# EAGLE design battery_board (EAGLE 6.6.0)
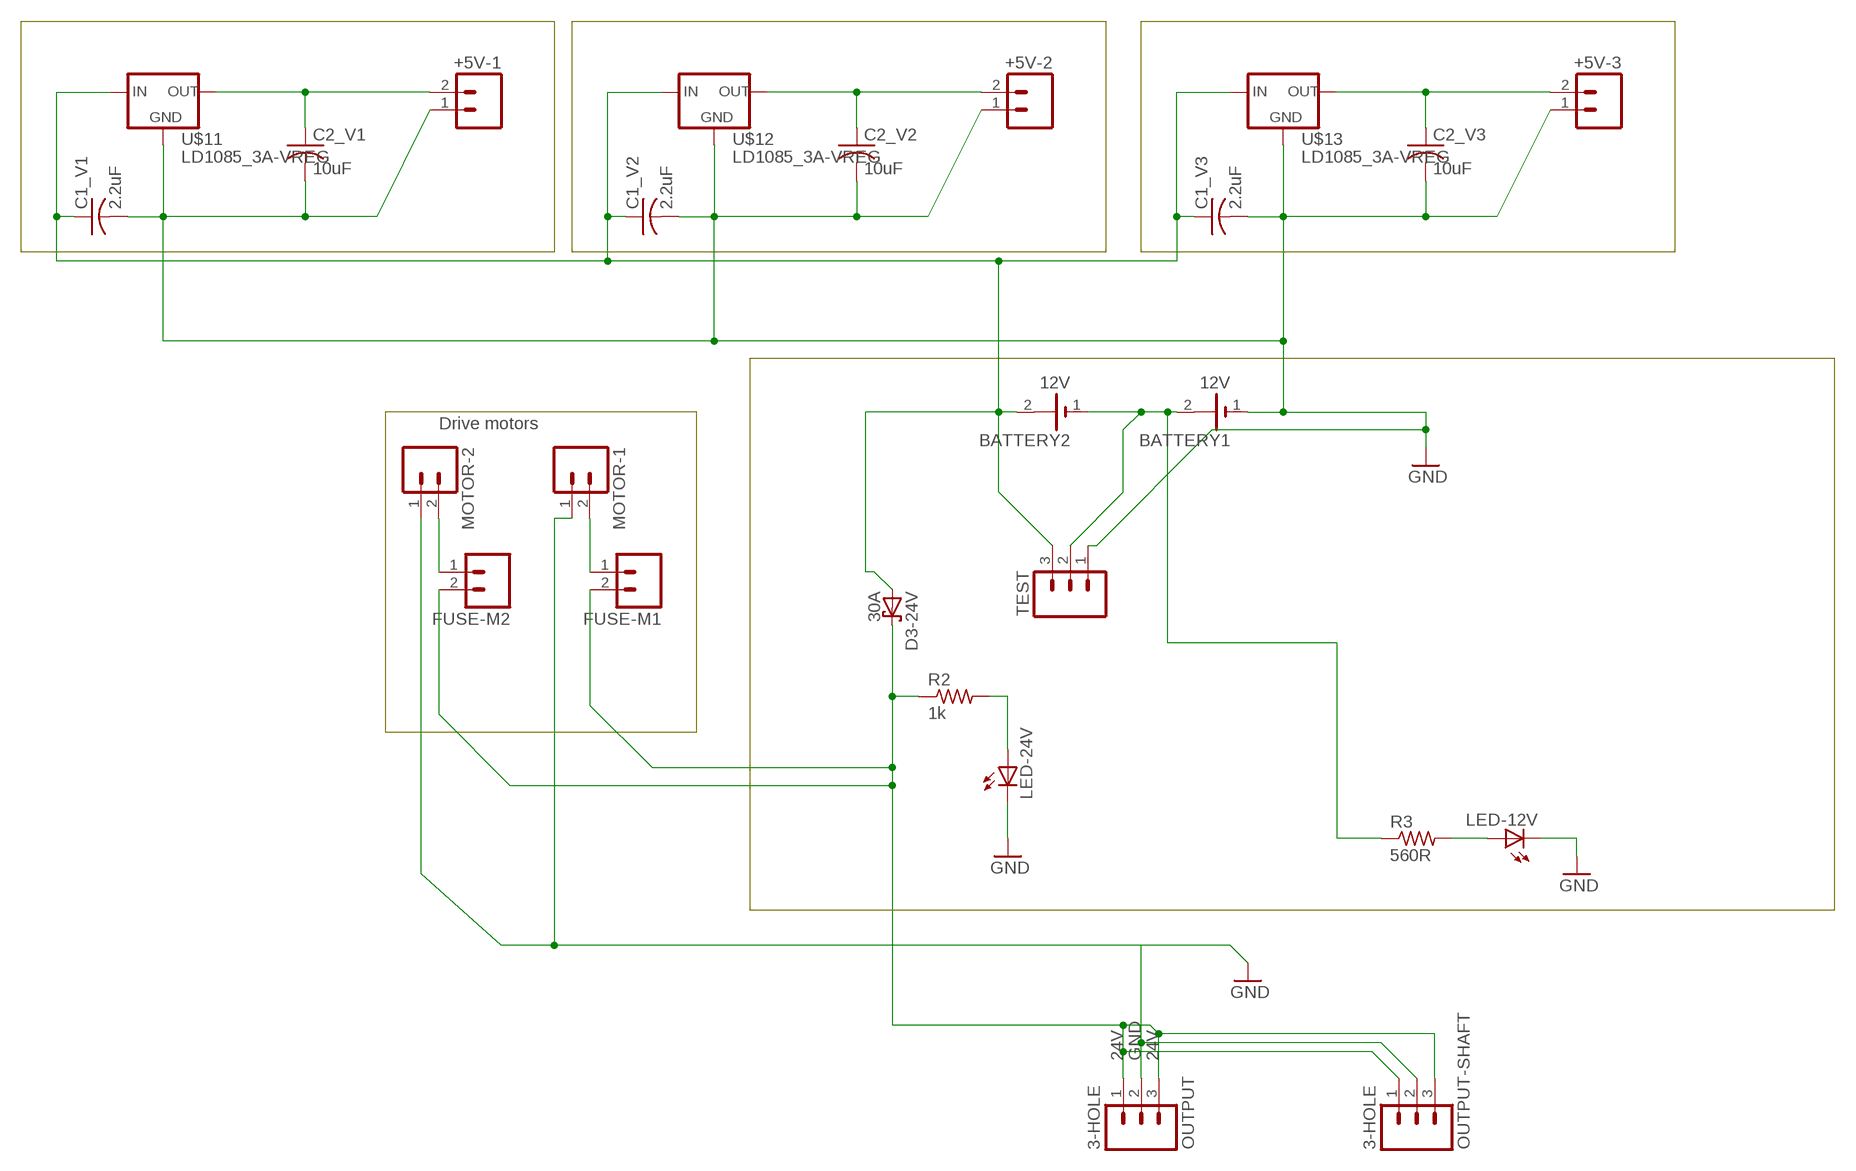
[diagram p0: schematic, sheet 1]

## Parts
+5V-1  2-HOLESSC3.81MM  [SCREWTERMINAL-3.81MM]
+5V-2  2-HOLESSC3.81MM  [SCREWTERMINAL-3.81MM]
+5V-3  2-HOLESSC3.81MM  [SCREWTERMINAL-3.81MM]
BATTERY1  12V  BATTERY-ST  [SCREWTERMINAL-5MM-2]
BATTERY2  12V  BATTERY-ST  [SCREWTERMINAL-5MM-2]
C1_V1  2.2uF  CAPACITOR  [C050-024X044]
C1_V2  2.2uF  CAPACITOR  [C050-024X044]
C1_V3  2.2uF  CAPACITOR  [C050-024X044]
C2_V1  10uF  CAPACITOR  [C050-024X044]
C2_V2  10uF  CAPACITOR  [C050-024X044]
C2_V3  10uF  CAPACITOR  [C050-024X044]
D3-24V  30A  POWER_RECTIFIER-H  [TO22-DIODE-H]
FUSE-M1  3A  2-HOLESSC5MM  [SCREWTERMINAL-5MM-2]
FUSE-M2  3A  2-HOLESSC5MM  [SCREWTERMINAL-5MM-2]
LED-12V  LED-5MM  [LED5MM]
LED-24V  LED-5MM  [LED5MM]
MOTOR-1  2-HOLESSC5MM  [SCREWTERMINAL-5MM-2]
MOTOR-2  2-HOLESSC5MM  [SCREWTERMINAL-5MM-2]
OUTPUT  3-HOLE  [SCREWTERMINAL-5MM-3@1]
OUTPUT-SHAFT  3-HOLE  [SCREWTERMINAL-5MM-3@1]
R2  1k  RESISTOR0309/15  [0309/15]
R3  560R  RESISTOR0309/15  [0309/15]
TEST  M03PTH  [1X03]
U$11  LD1085_3A-VREG  [TO220V-HEATSINK2]
U$12  LD1085_3A-VREG  [TO220V-HEATSINK2]
U$13  LD1085_3A-VREG  [TO220V-HEATSINK2]

## Nets
12V [battery]: BATTERY2.2(+) C1_V1.1 C1_V2.1 C1_V3.1 D3-24V.P$1(A) TEST.3 U$11.3(IN) U$12.3(IN) U$13.3(IN)
24V [battery]: D3-24V.P$2(C) FUSE-M1.2 FUSE-M2.2 OUTPUT-SHAFT.1 OUTPUT-SHAFT.3 OUTPUT.1 OUTPUT.3 R2.1
GND [ground]: +5V-1.1 +5V-2.1 +5V-3.1 BATTERY1.1(-) C1_V1.2 C1_V2.2 C1_V3.2 C2_V1.2 C2_V2.2 C2_V3.2 LED-12V.K(C) LED-24V.K(C) MOTOR-1.1 MOTOR-2.1 OUTPUT-SHAFT.2 OUTPUT.2 TEST.1 U$11.1(GND) U$12.1(GND) U$13.1(GND)
N$3: LED-24V.A R2.2
N$5 [battery]: BATTERY1.2(+) BATTERY2.1(-) R3.1 TEST.2
N$8 [battery]: +5V-3.2 C2_V3.1 U$13.2(OUT)
N$9: FUSE-M2.1 MOTOR-2.2
N$10: FUSE-M1.1 MOTOR-1.2
N$14: LED-12V.A R3.2
N$15 [battery]: +5V-2.2 C2_V2.1 U$12.2(OUT)
N$17 [battery]: +5V-1.2 C2_V1.1 U$11.2(OUT)

## Notes on the sheet
- Drive motors

## Library data of the parts
+5V-1-+5V-3 FUSE-M1 FUSE-M2 MOTOR-1 MOTOR-2 = parts:2-HOLES: TERMINAL 2-PIN Holes for connecting 2 pin terminal
BATTERY1 BATTERY2 = parts:BATTERY: BATTERY battery with hole variants to mount to board
C1_V1-C1_V3 C2_V1-C2_V3 = parts:CAPACITOR: CAPACITOR, American symbol
D3-24V = parts:POWER_RECTIFIER: <DIODE NTST30100SG Schottky 100V 30A rectifier
LED-12V LED-24V = parts:LED: LEDs Standard schematic elements and footprints for 5mm, 3mm, 1206, and 0603 sized LEDs. 5mm - Spark Fun Electronics SKU : COM-00529 (and others)
OUTPUT OUTPUT-SHAFT = parts:3-HOLE: TERMINAL 3-PIN
R2 R3 = parts:RESISTOR: RESISTOR
TEST = parts:M03: Header 3 Standard 3-pin 0.1" header. Use with straight break away headers (SKU : PRT-00116), right angle break away headers (PRT-00553), swiss pins (PRT-00743), machine pins (PRT-00117), and female headers (PRT-00115). Molex polarized connector foot print use with SKU : PRT-08232 with associated crimp pins and housings.
U$11-U$13 = parts:LD1085_3A-VREG

## Net classes
1 ground: width 1.27 mm, clearance 0.762 mm
2 battery: width 1.524 mm, clearance 0.762 mm

## Board
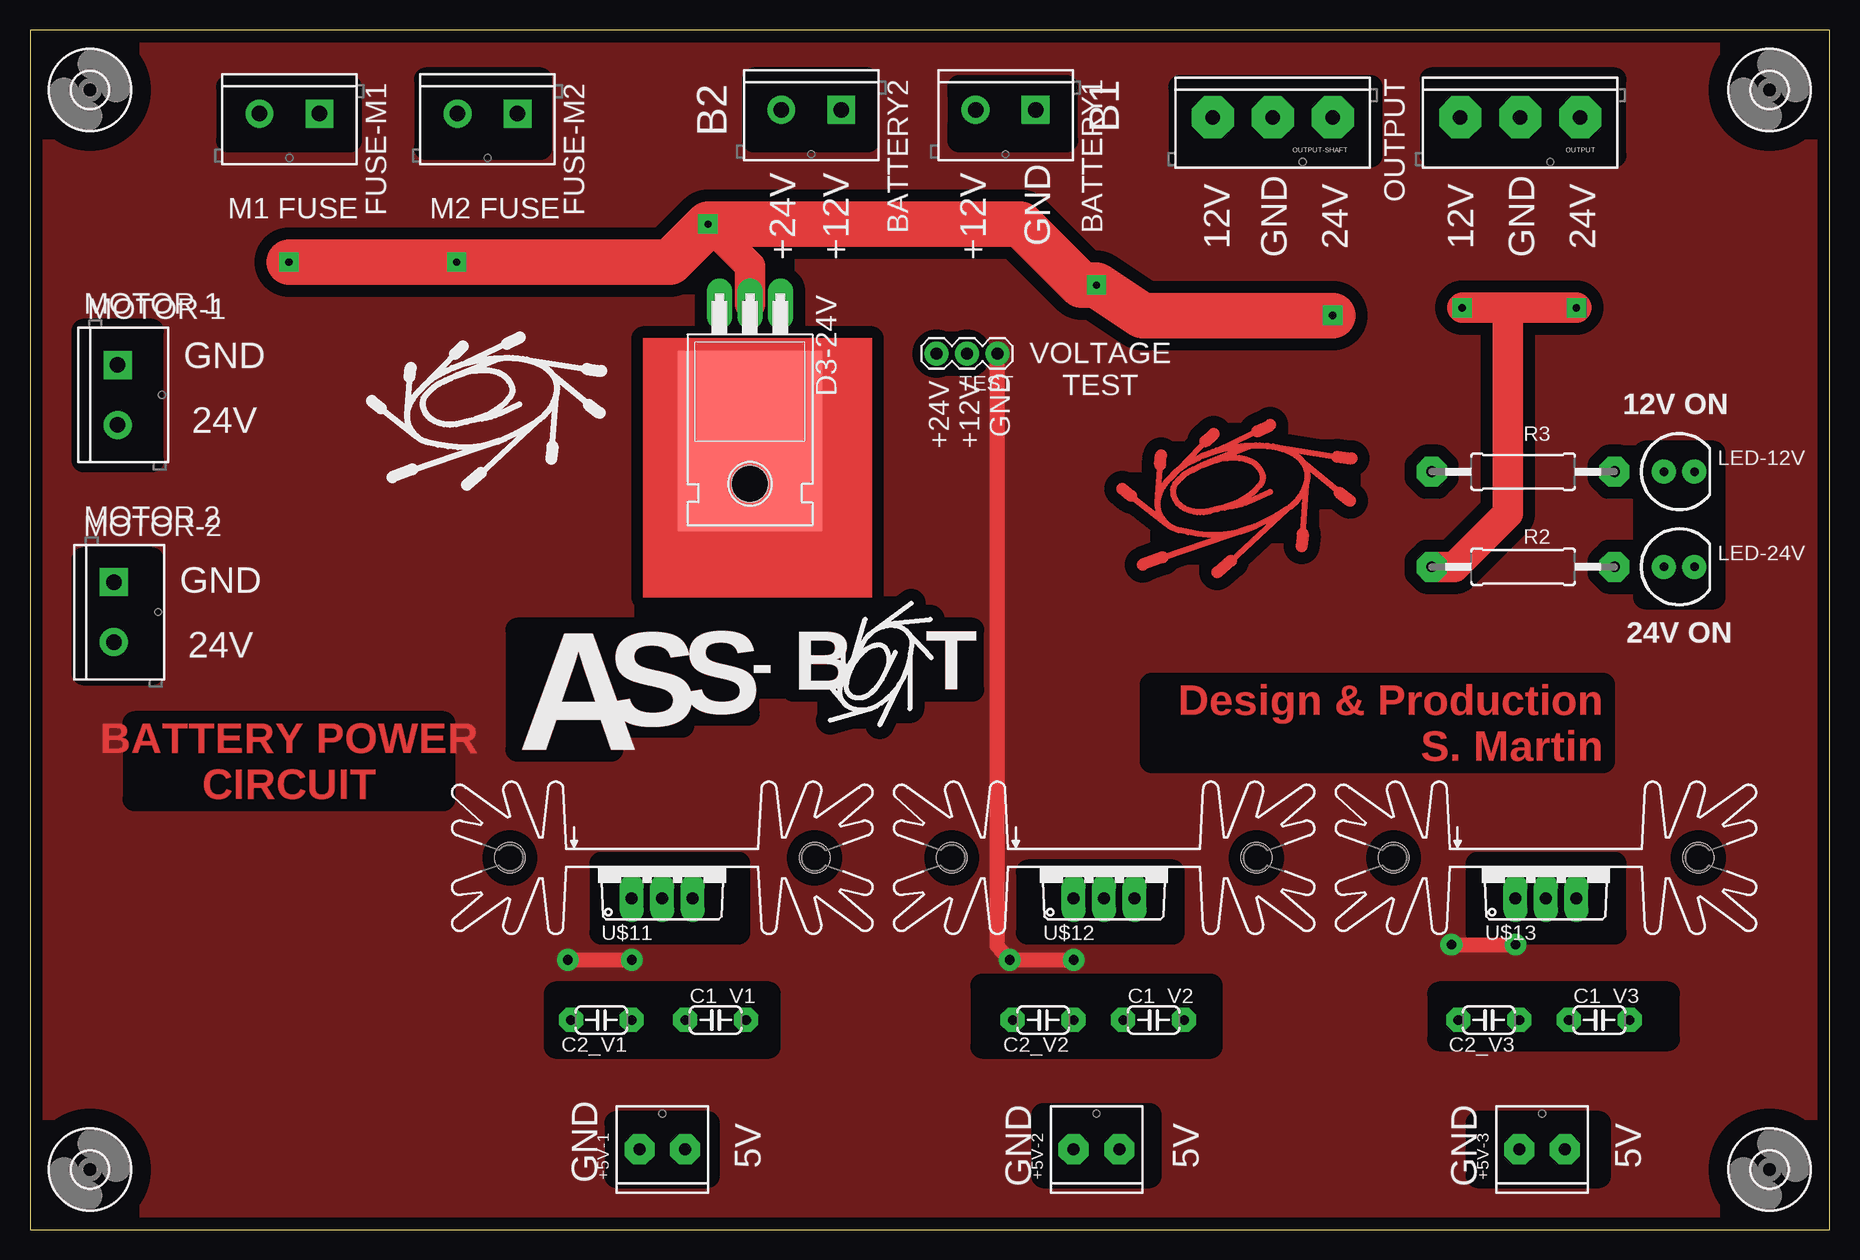
[diagram p1: board, top side]
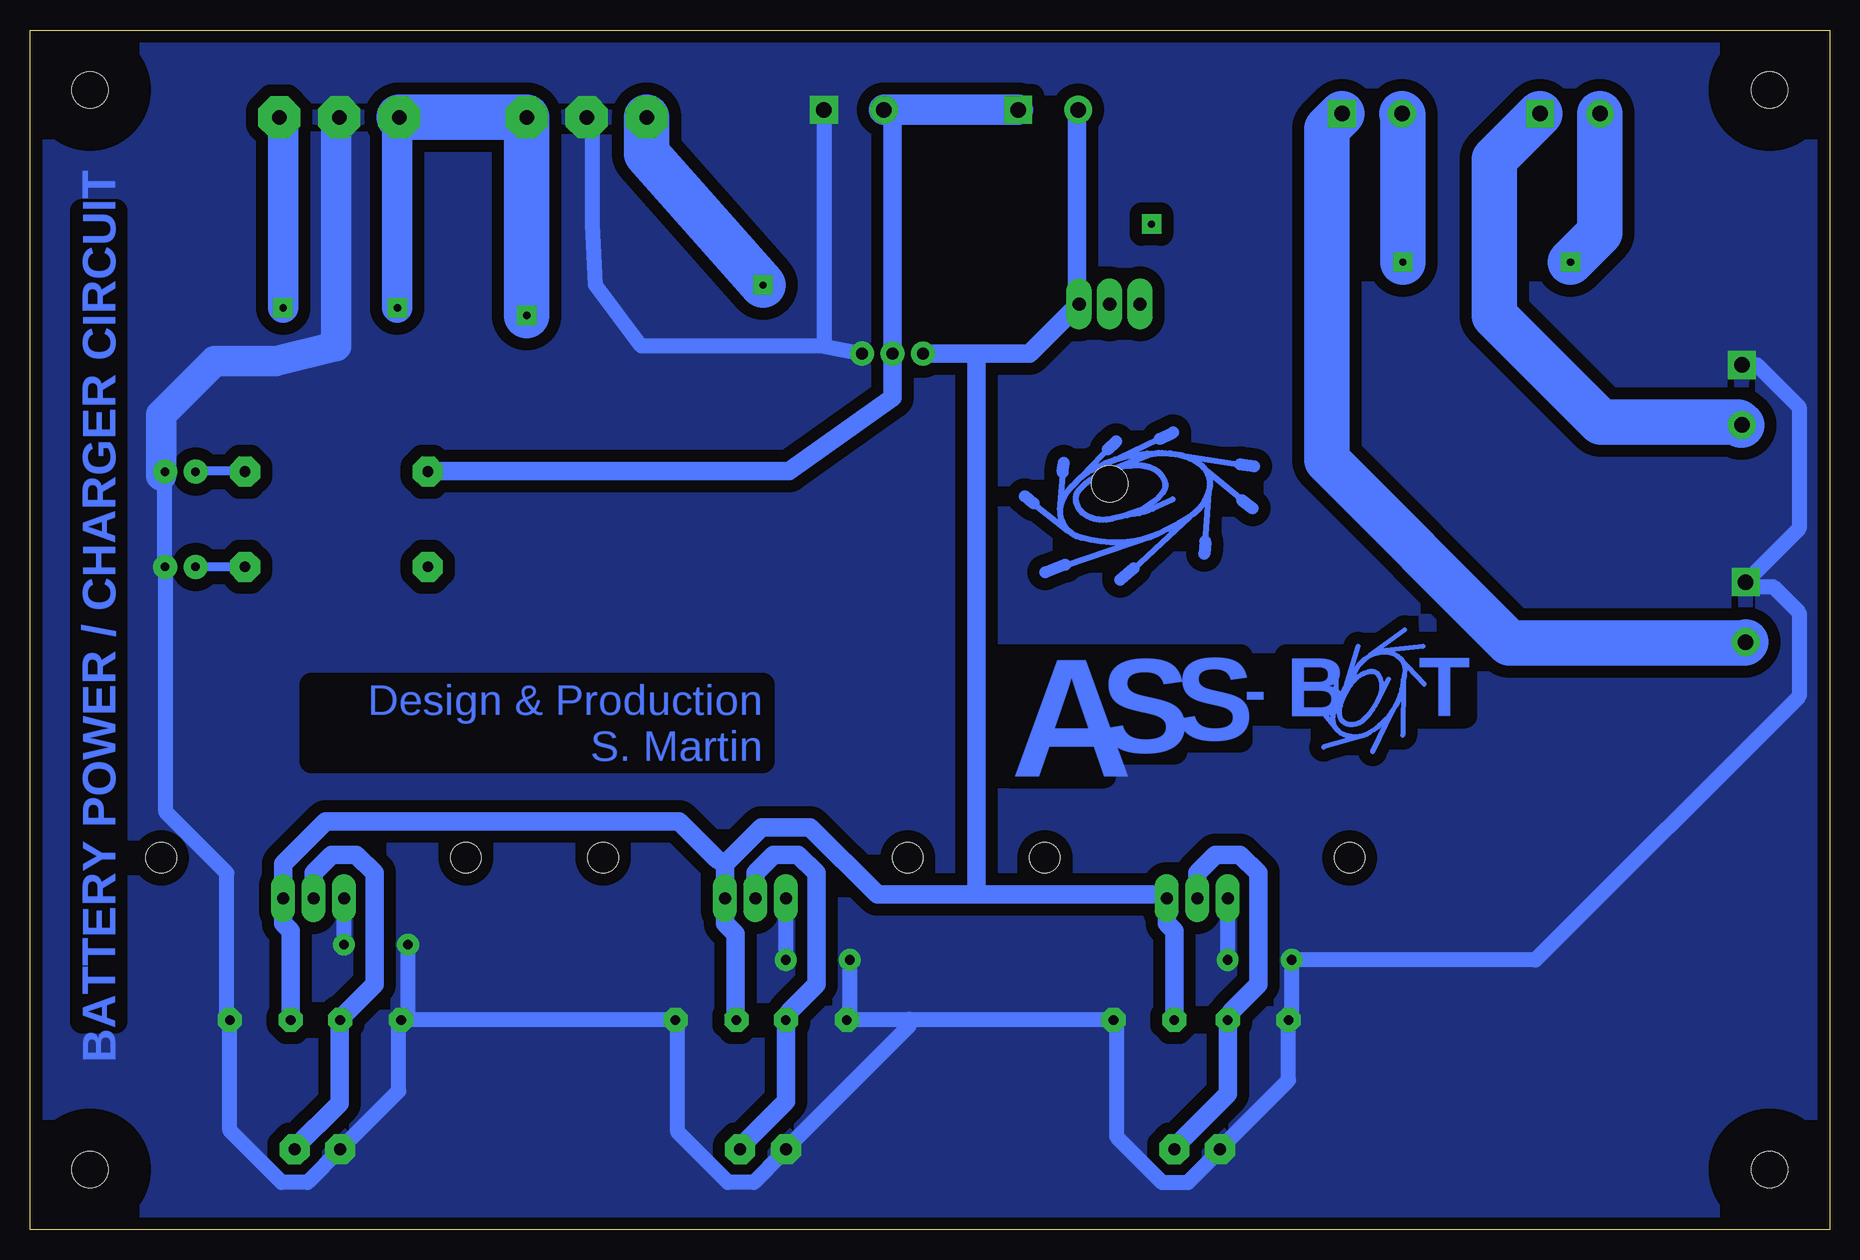
[diagram p2: board, bottom side, seen from below]

Size 150 x 100 mm. Coordinates in mm from the lower left corner, seen from the top.
Outline: 0,0 150,0 150,100 0,100 0,0
Copper layers (1*16): Top 0.035mm / dielectric 1.5mm / Bottom 0.035mm
Design rules "rules *": minimum track width 30mil, minimum drill 0.8mm, track to track 20mil, track to pad 20mil, pad to pad 30mil, via to via 30mil, smd to smd 8mil, copper to edge 40mil, drill to drill 8mil, minimum pad ring 20mil, minimum via ring 20mil, stop-mask expansion 20mil, vias tented up to drill 0mil, thermal gap 0mil
tRestrict: area 82.5,92.1 to 85.4,94.6; area 77.5,92.1 to 80.6,94.6; area 61.3,92.1 to 64.1,94.6; area 66,91.8 to 68.9,94.6; area 16.5,90.8 to 26.7,95.2; area 33,90.2 to 42.5,95.9; area 60.3,90.8 to 69.8,95.9; area 77.5,90.8 to 86.4,95.2; area 95.9,89.5 to 111.8,95.2; area 116.8,89.5 to 132.1,95.9; area 134.6,52.7 to 140.3,64.8; area 4.4,46.4 to 10.2,55.9; 10 more areas

### Footprints (pad centres in the part's own frame; a part is rotated, then mirrored left to right if it is on the bottom)
SCREWTERMINAL-3.81MM = drill 1 pad 2.5 octagon: 1 0,0; 2 3.81,0
SCREWTERMINAL-5MM-2 = drill 1.3 pad 2.032 square: 1 0,0 | drill 1.3 pad 2.032: 2 5,0
C050-024X044 = drill 0.8 pad 2 octagon: 1 -2.54,0; 2 2.54,0
TO22-DIODE-H = drill 1.1 long: @P$1 2.54,-7.62; P$1 -2.54,-7.62; P$2 0,-7.62 | smd 12 x 15: @P$2 0,3.81 | hole 3: 0,7.366
LED5MM = drill 0.7 pad 2: A -1.27,0; K 1.27,0
SCREWTERMINAL-5MM-3@1 = drill 1.2 pad 3.5 octagon: 1 0,0; 2 5,0; 3 10,0
0309/15 = drill 0.9 pad 2.5 octagon: 1 -7.62,0; 2 7.62,0
1X03 = drill 1.016 pad 1.88: 1 0,0; 2 2.54,0; 3 5.08,0
3,0 = hole 3: 0,0
TO220V-HEATSINK2 = drill 1 long: 1 -2.54,-2.54; 2 0,-2.54; 3 2.54,-2.54 | hole 2.54: -12.7,0.826; 12.7,0.826

### Placement (x,y rotation side)
+5V-1  50.8,6.67 0 top
+5V-2  87,6.67 0 top
+5V-3  124.14,6.67 0 top
BATTERY1  83.82,93.34 180 top
BATTERY2  67.63,93.34 180 top
C1_V1  57.15,17.46 0 top
C1_V2  93.66,17.46 0 top
C1_V3  130.81,17.46 0 top
C2_V1  47.62,17.46 180 top
C2_V2  84.45,17.46 180 top
C2_V3  121.6,17.46 180 top
D3-24V  60.01,69.53 180 top
FUSE-M1  24.13,93.03 180 top
FUSE-M2  40.64,93.03 180 top
LED-12V  137.48,63.18 0 top
LED-24V  137.48,55.24 0 top
MOTOR-1  7.3,72.07 270 top
MOTOR-2  6.99,53.98 270 top
OUTPUT  129.22,92.71 180 top
OUTPUT-SHAFT  108.58,92.71 180 top
R2  124.46,55.24 0 top
R3  124.46,63.18 0 top
TEST  80.64,73.03 180 top
U$1  [LOGO-SYNCHROTRON]  99.69,61.91 0 top
U$2  [LOGO-ASSBOT-SILK]  40.64,40.01 0 top
U$3  [3,0]  5,95 0 top
U$4  [3,0]  145,95 0 top
U$5  [3,0]  145,5 0 top
U$6  [3,0]  5,5 0 top
U$7  [LOGO-ASSBOT]  68.26,37.78 0 bottom
U$8  [LOGO-SYNCHROTRON]  58.42,61.28 0 bottom
U$9  [LOGO-ASSBOT]  40.64,40.01 0 top
U$10  [LOGO-SYNCHROTRON-SILK]  37.15,69.22 0 top
U$11  52.7,30.16 0 top
U$12  89.53,30.16 0 top
U$13  126.36,30.16 0 top

### Tracks (layer width: path | path; a pad name or v marks a point on that pad's centre or on a via)
12V
  Bottom 1.524: 71.12,73.03 66.67,73.03 D3-24V.P$1 62.74,77.85 62.74,93.34 BATTERY2.2 | 71.12,73.03 TEST.3 | C1_V3.1 128.27,24.89 128.91,25.53 U$13.3 128.91,30.48 125.35,34.04 95.89,34.04 92.71,30.86 92.08,30.48 | C1_V1.1 54.61,24.89 55.24,25.53 U$11.3 55.88,27.94 71.12,27.94 | C1_V2.1 91.19,17.53 91.19,24.64 92.08,25.53 U$12.3 92.08,30.48 | 71.12,27.94 79.38,27.94 84.96,33.53 89.03,33.53 92.08,30.48 | 71.12,27.94 71.12,73.03
24V  (via drill 0.6)
  Top 2.54: D3-24V.P$2 60.01,80.33 v56.52,83.82 | v128.91,76.83 123.19,76.83 | v119.38,76.83 123.19,76.83 | 123.19,76.83 123.19,59.69 118.75,55.24 R2.1
  Top 3.81: v21.59,80.64 v35.56,80.64 53.34,80.64 v56.52,83.82 82.55,83.82 87.63,78.74 v88.9,78.74 92.71,76.2 v108.58,76.2
  Bottom 1.524: 119.63,92.33 119.32,92.65 119.25,92.71 OUTPUT.3 | 129.16,92.71 OUTPUT.1
  Bottom 2.54: 129.16,92.71 128.91,92.46 v128.91,76.83 | v119.38,76.83 119.38,92.08 119.32,92.14 119.32,92.65
  Bottom 3.81: FUSE-M2.2 35.56,92.95 v35.56,80.64 | FUSE-M1.2 19.13,83.11 v21.59,80.64 | OUTPUT.3 OUTPUT-SHAFT.1 v108.58,76.2 | OUTPUT-SHAFT.3 98.58,89.69 v88.9,78.74
GND  (via drill 0.8)
  Top 1.27: v118.49,23.75 v123.83,23.75 | v44.83,22.48 v50.16,22.48 | v87,22.48 v81.66,22.48 80.64,23.62 TEST.1
  Bottom 1.016: 139.06,62.87 LED-12V.K
  Bottom 1.27: C2_V3.2 119,17.53 96.27,17.53 C1_V2.2 96.01,16.89 96.01,8.13 91.82,3.94 89.66,3.94 87.38,6.22 +5V-2.1 87,6.73 76.71,17.02 76.71,17.53 | v123.83,23.75 U$13.1 | v118.49,23.75 118.49,18.03 C2_V3.2 | LED-12V.K 138.81,63.12 138.81,55.24 LED-24V.K 138.68,54.74 138.68,34.8 133.6,29.72 133.6,18.03 C1_V3.2 133.35,8.26 129.03,3.94 126.87,3.94 +5V-3.1 119.25,11.56 119.25,16.89 C2_V3.2 | v50.16,22.48 U$11.1 | 83.82,73.66 TEST.1 | BATTERY1.1 83.82,73.66 | OUTPUT-SHAFT.2 103.12,92.71 103.12,83.82 102.87,78.74 99.06,73.66 83.82,73.66 | 76.71,17.53 81.92,17.53 C2_V2.2 81.66,18.03 v81.66,22.48 | 76.71,17.53 59.69,17.53 C1_V1.2 59.44,16.89 59.44,7.75 55.63,3.94 53.47,3.94 51.18,6.22 +5V-1.1 50.8,6.73 45.09,12.45 C2_V1.2 44.83,18.03 v44.83,22.48 24.51,22.48 2.54,44.45 2.54,51.44 4.7,53.59 7.49,53.59 MOTOR-2.1 2.54,58.42 2.54,68.58 6.03,72.07 MOTOR-1.1 | v87,22.48 U$12.1
  Bottom 2.54: OUTPUT.2 124.46,92.47 124.46,73.66 129.54,72.39 134.62,72.39 139.06,67.94 139.06,62.87
  pour Bottom (isolate 1): 0,0 149.86,0 149.86,100.33 0,100.33
  pour Top (isolate 1): 0,-0.64 149.86,-0.64 149.86,99.69 0,99.69
N$3
  Bottom 0.762: R2.2 LED-24V.A
N$5
  Bottom 1.524: BATTERY1.2 78.74,93.34 78.11,92.71 TEST.2 78.11,69.34 86.74,63.25 116.84,63.25 R3.1
  Bottom 2.54: BATTERY1.2 BATTERY2.1
N$8
  Bottom 1.524: +5V-3.2 128.02,6.73 124.21,10.54 124.21,17.4 C2_V3.1 123.7,18.03 121.28,20.45 121.28,29.72 122.81,31.24 124.84,31.24 126.36,29.72 U$13.2
N$9
  Bottom 3.81: MOTOR-2.2 7.07,48.9 26.67,48.9 41.91,64.14 41.91,91.76 FUSE-M2.1
N$10
  Bottom 3.81: FUSE-M1.1 27.94,89.22 27.94,76.2 19.05,67.31 7.62,67.31 7.38,67.07 MOTOR-1.2
N$14
  Bottom 0.762: LED-12V.A 136.14,63.25 132.08,63.25 R3.2
N$15
  Bottom 1.524: +5V-2.2 90.81,6.86 87,10.67 C2_V2.1 86.74,18.16 84.45,20.45 84.45,29.72 85.98,31.24 88.01,31.24 89.53,29.72 U$12.2
N$17
  Bottom 1.524: +5V-1.2 54.61,6.86 50.16,11.3 C2_V1.1 49.91,18.16 47.62,20.45 47.62,29.72 49.15,31.24 51.18,31.24 52.7,29.72 U$11.2
(copper drawn outside any net)
  shapes: Top area x1

### Text on the board
Top: Design & Production / S. Martin | BATTERY POWER / CIRCUIT
Bottom: BATTERY POWER / CHARGER CIRCUIT | Design & Production / S. Martin
_tplace: B1 | B2 | OUTPUT | M1 FUSE | M2 FUSE | GND | +24V | +12V | +12V | 12V | GND | 24V | 12V | GND | 24V | MOTOR 1 | GND | VOLTAGE / TEST | 24V | GND | +24V | +12V | 12V ON | MOTOR 2 | GND | 24V | 24V ON | GND | 5V | GND | 5V | GND | 5V